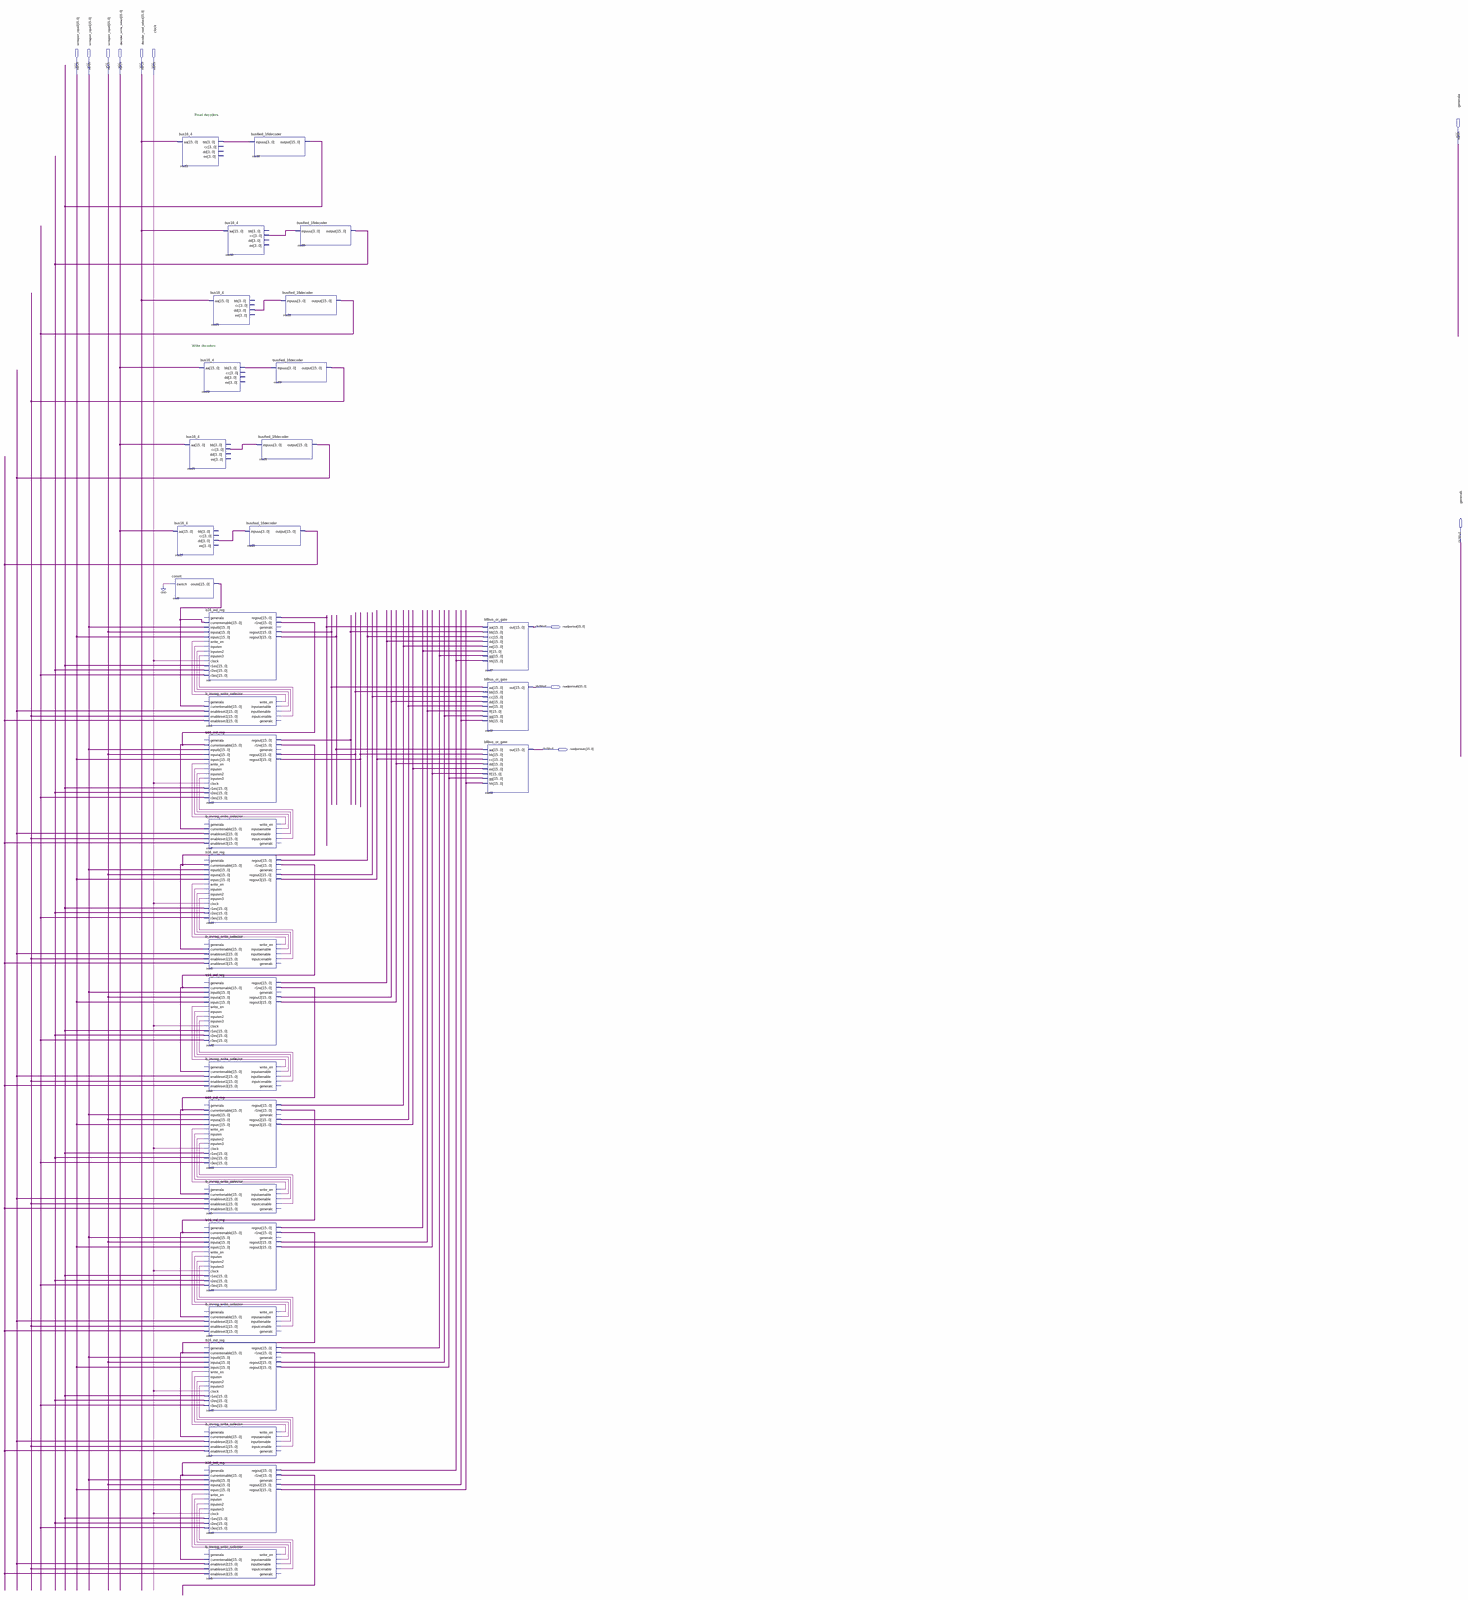
[diagram p0: schematic sheet, whole]
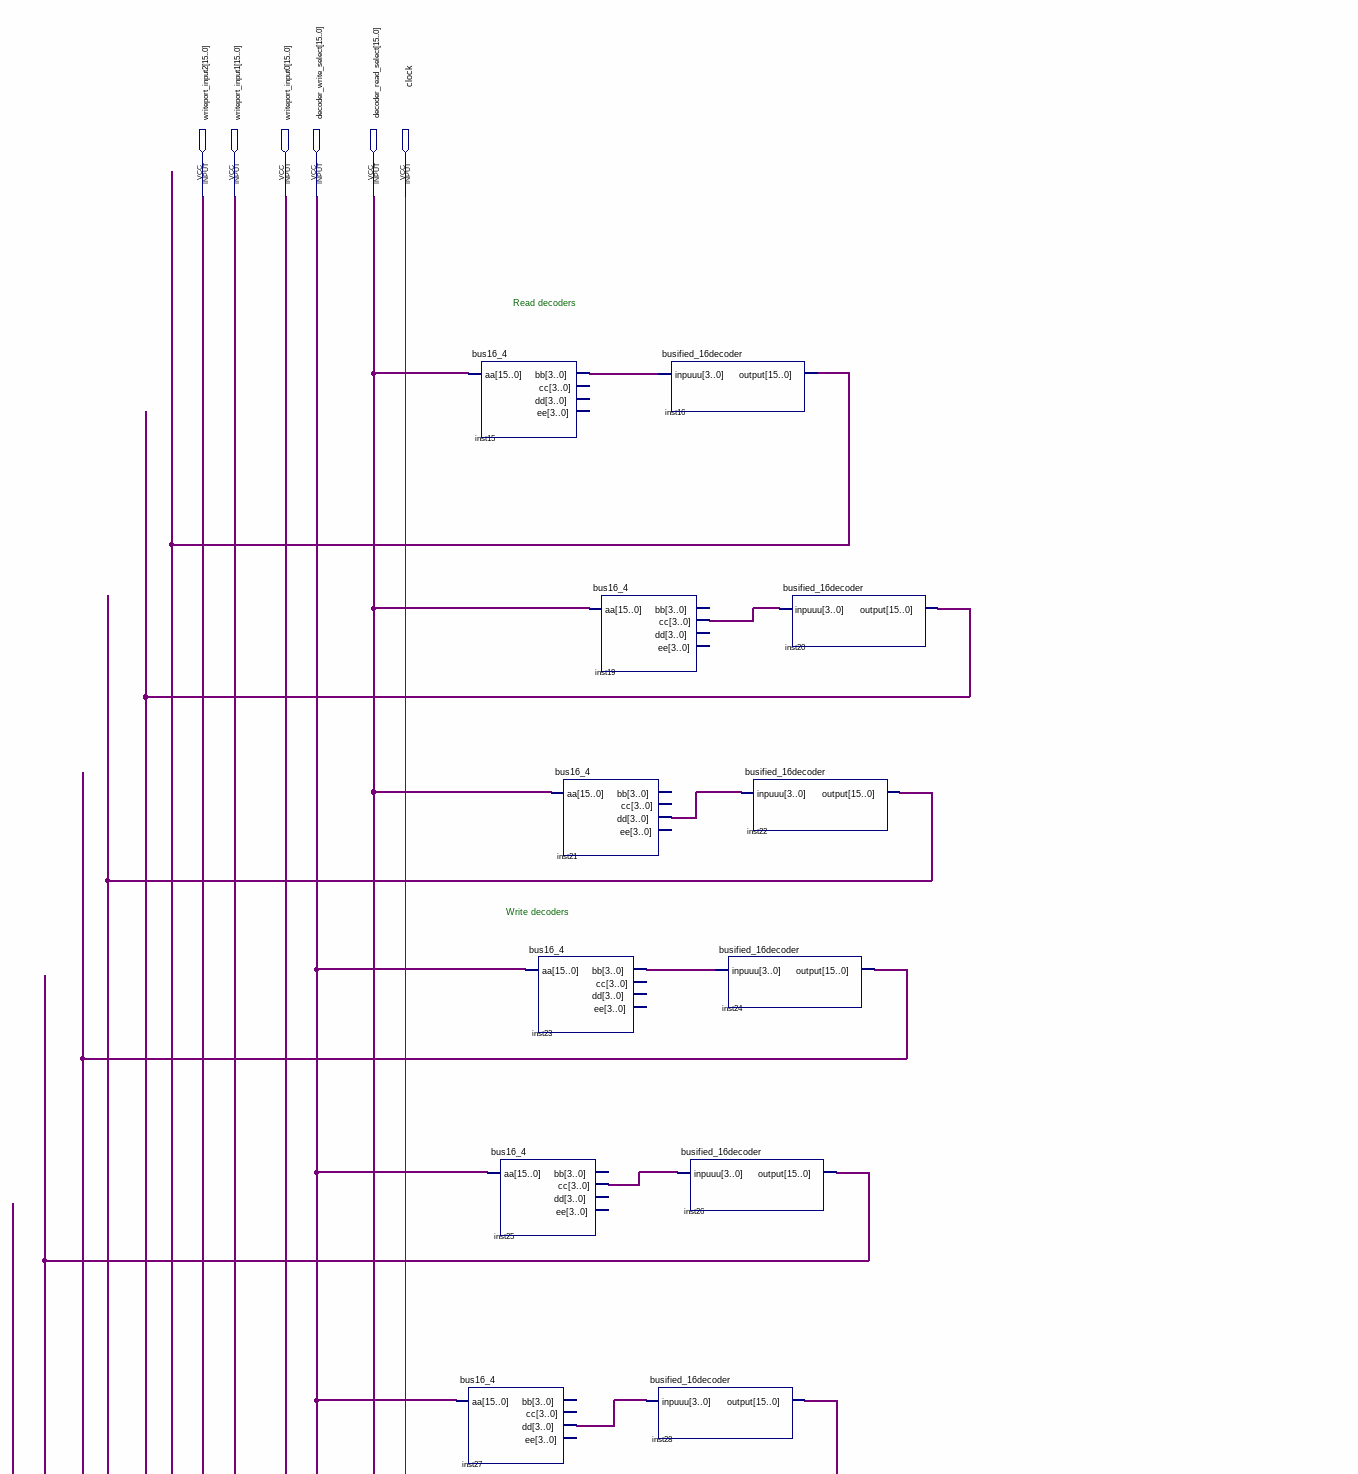
[diagram p1: schematic sheet, upper left part]
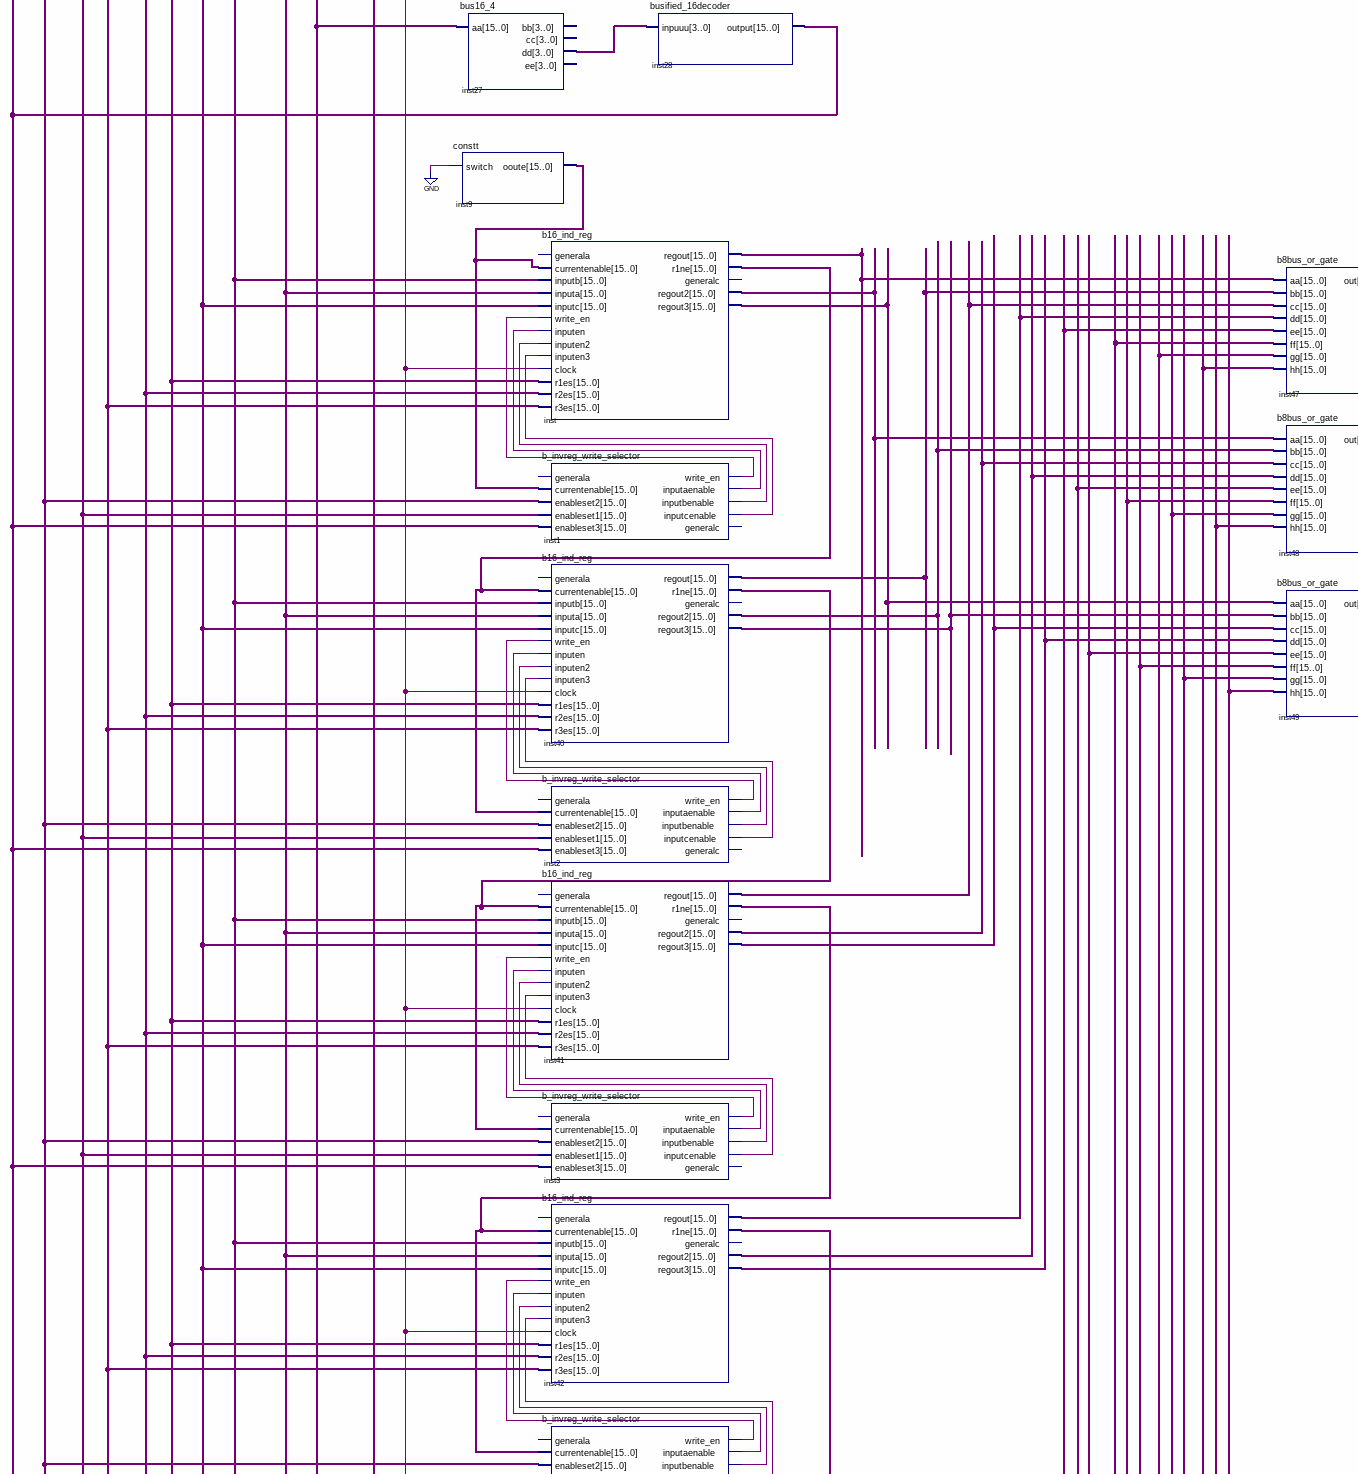
[diagram p2: schematic sheet, middle left part]
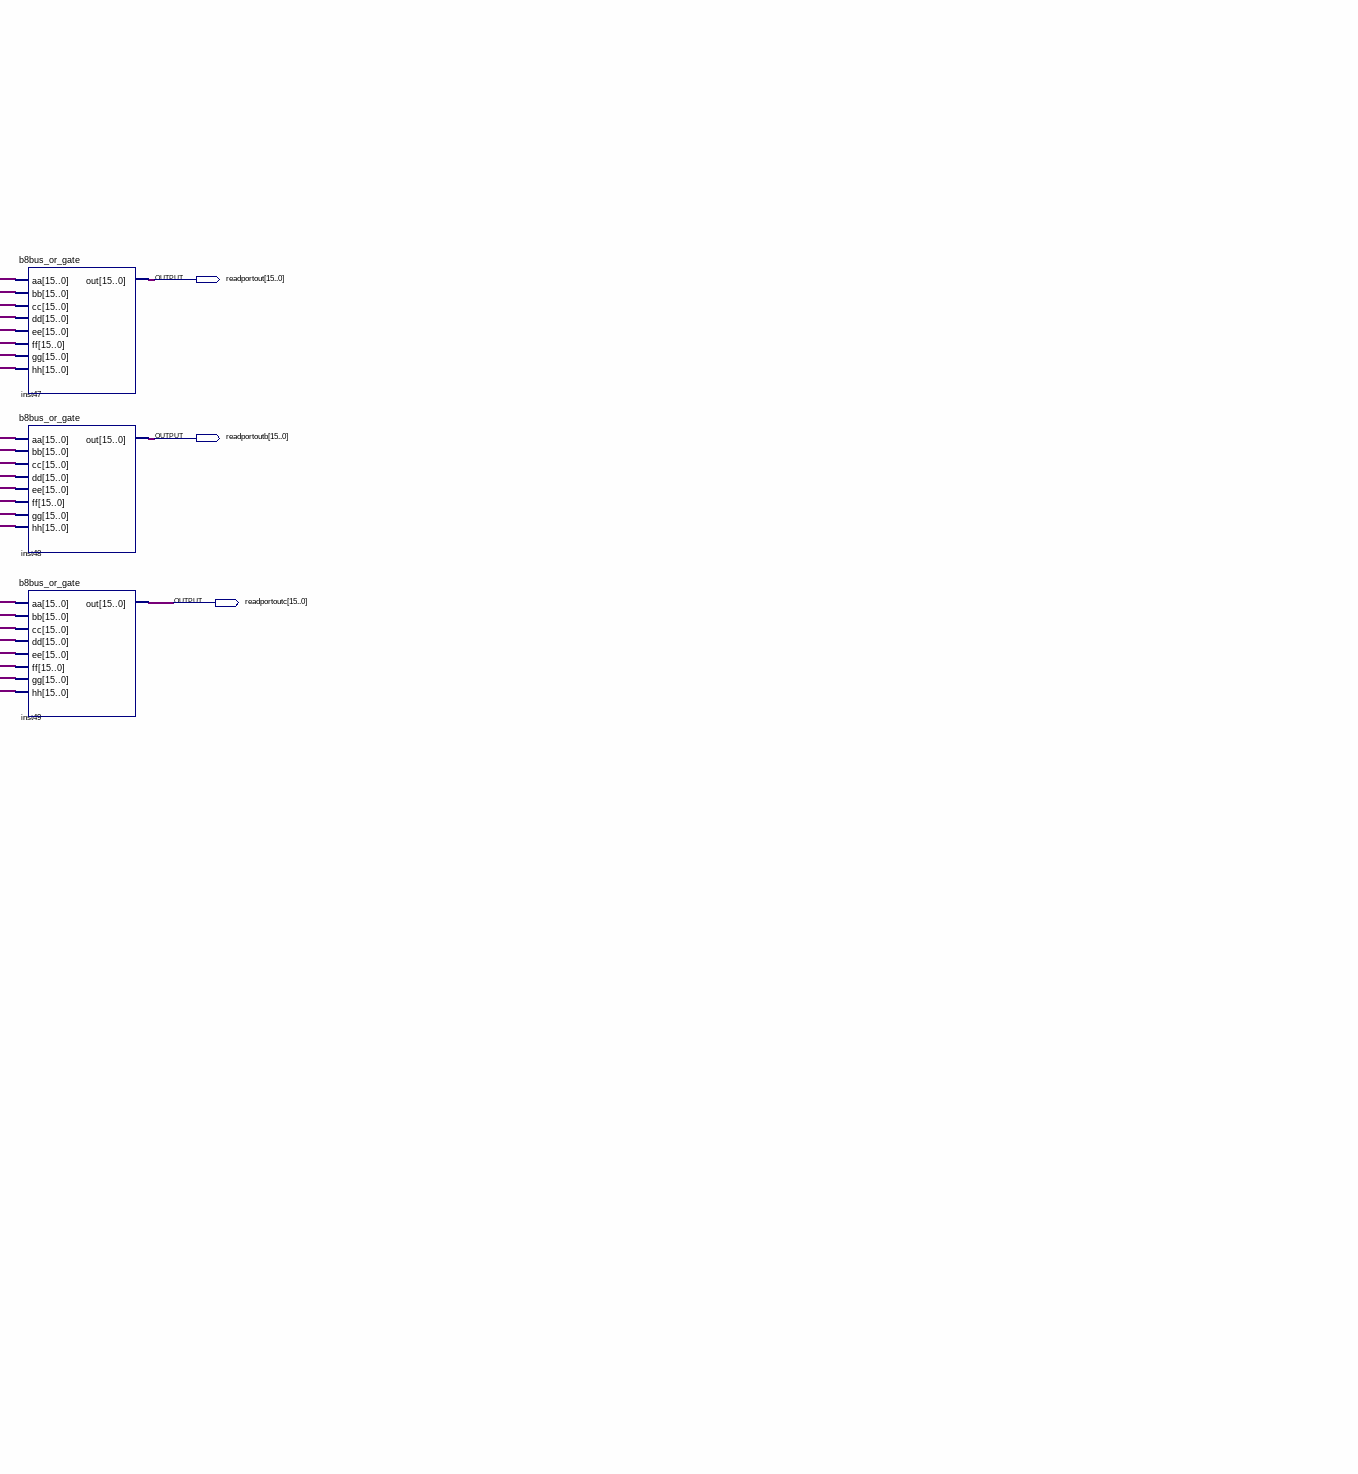
[diagram p3: schematic sheet, middle centre part]
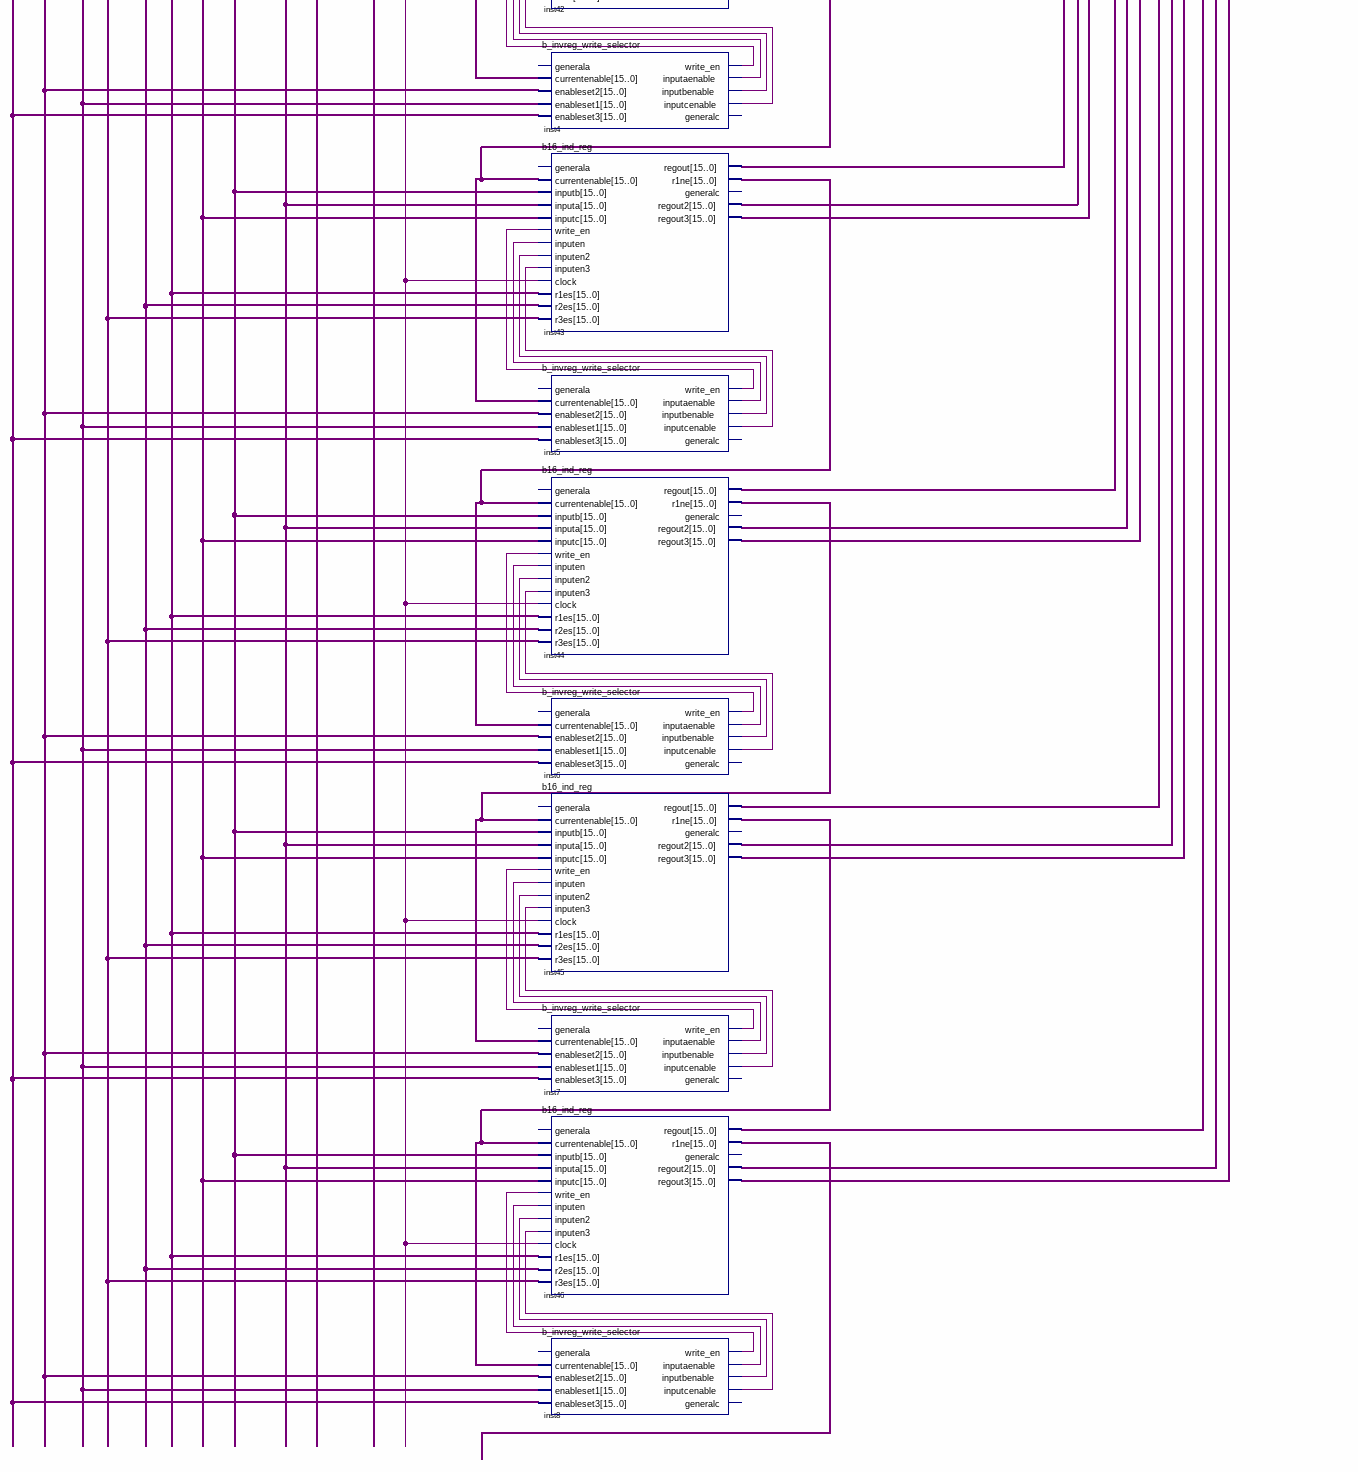
[diagram p4: schematic sheet, lower left part]
// Quartus schematic reg_mod.bdf as structural Verilog: 32 symbols, 11 pins
module reg_mod (
  input  [15:0] writeport_input2,
  input  [15:0] writeport_input1,
  input  [15:0] writeport_input0,
  input  [15:0] decoder_write_select,
  input  [15:0] decoder_read_select,
  input  clock,
  input  generala,
  output generalc,
  output [15:0] readportout,
  output [15:0] readportoutb,
  output [15:0] readportoutc
);

  wire inst1_inputaenable, inst1_inputbenable, inst1_inputcenable, inst1_write_en, inst2_inputaenable,
       inst2_inputbenable, inst2_inputcenable, inst2_write_en, inst3_inputaenable, inst3_inputbenable,
       inst3_inputcenable, inst3_write_en, inst4_inputaenable, inst4_inputbenable, inst4_inputcenable,
       inst4_write_en, inst5_inputaenable, inst5_inputbenable, inst5_inputcenable, inst5_write_en,
       inst6_inputaenable, inst6_inputbenable, inst6_inputcenable, inst6_write_en, inst7_inputaenable,
       inst7_inputbenable, inst7_inputcenable, inst7_write_en, inst8_inputaenable, inst8_inputbenable,
       inst8_inputcenable, inst8_write_en;
  wire [3:0] inst15_bb, inst19_cc, inst21_dd, inst23_bb, inst25_cc, inst27_dd;
  wire [15:0] inst9_ooute, inst16_output, inst20_output, inst22_output, inst24_output, inst26_output,
       inst28_output, inst40_r1ne, inst40_regout, inst40_regout2, inst40_regout3, inst41_r1ne, inst41_regout,
       inst41_regout2, inst41_regout3, inst42_r1ne, inst42_regout, inst42_regout2, inst42_regout3,
       inst43_r1ne, inst43_regout, inst43_regout2, inst43_regout3, inst44_r1ne, inst44_regout,
       inst44_regout2, inst44_regout3, inst45_r1ne, inst45_regout, inst45_regout2, inst45_regout3,
       inst46_r1ne, inst46_regout, inst46_regout2, inst46_regout3, inst_r1ne, inst_regout, inst_regout2,
       inst_regout3;

  bus16_4 inst15 (.aa(decoder_read_select), .bb(inst15_bb));  // open: cc, dd, ee
  bus16_4 inst27 (.aa(decoder_write_select), .dd(inst27_dd));  // open: bb, cc, ee
  constt inst9 (.switch(1'b0), .ooute(inst9_ooute));
  bus16_4 inst23 (.aa(decoder_write_select), .bb(inst23_bb));  // open: cc, dd, ee
  bus16_4 inst25 (.aa(decoder_write_select), .cc(inst25_cc));  // open: bb, dd, ee
  bus16_4 inst21 (.aa(decoder_read_select), .dd(inst21_dd));  // open: bb, cc, ee
  b16_ind_reg inst (
    .currentenable(inst9_ooute), .inputb(writeport_input1), .inputa(writeport_input0),
    .inputc(writeport_input2), .write_en(inst1_write_en), .inputen(inst1_inputaenable),
    .inputen2(inst1_inputbenable), .inputen3(inst1_inputcenable), .clock(clock), .r1es(inst16_output),
    .r2es(inst20_output), .r3es(inst22_output), .regout(inst_regout), .r1ne(inst_r1ne),
    .regout2(inst_regout2), .regout3(inst_regout3));  // open: generala, generalc
  b_invreg_write_selector inst1 (
    .currentenable(inst9_ooute), .enableset2(inst26_output), .enableset1(inst24_output),
    .enableset3(inst28_output), .write_en(inst1_write_en), .inputaenable(inst1_inputaenable),
    .inputbenable(inst1_inputbenable), .inputcenable(inst1_inputcenable));  // open: generala, generalc
  b16_ind_reg inst40 (
    .currentenable(inst_r1ne), .inputb(writeport_input1), .inputa(writeport_input0),
    .inputc(writeport_input2), .write_en(inst2_write_en), .inputen(inst2_inputaenable),
    .inputen2(inst2_inputbenable), .inputen3(inst2_inputcenable), .clock(clock), .r1es(inst16_output),
    .r2es(inst20_output), .r3es(inst22_output), .regout(inst40_regout), .r1ne(inst40_r1ne),
    .regout2(inst40_regout2), .regout3(inst40_regout3));  // open: generala, generalc
  b_invreg_write_selector inst2 (
    .currentenable(inst_r1ne), .enableset2(inst26_output), .enableset1(inst24_output),
    .enableset3(inst28_output), .write_en(inst2_write_en), .inputaenable(inst2_inputaenable),
    .inputbenable(inst2_inputbenable), .inputcenable(inst2_inputcenable));  // open: generala, generalc
  b16_ind_reg inst41 (
    .currentenable(inst40_r1ne), .inputb(writeport_input1), .inputa(writeport_input0),
    .inputc(writeport_input2), .write_en(inst3_write_en), .inputen(inst3_inputaenable),
    .inputen2(inst3_inputbenable), .inputen3(inst3_inputcenable), .clock(clock), .r1es(inst16_output),
    .r2es(inst20_output), .r3es(inst22_output), .regout(inst41_regout), .r1ne(inst41_r1ne),
    .regout2(inst41_regout2), .regout3(inst41_regout3));  // open: generala, generalc
  b_invreg_write_selector inst3 (
    .currentenable(inst40_r1ne), .enableset2(inst26_output), .enableset1(inst24_output),
    .enableset3(inst28_output), .write_en(inst3_write_en), .inputaenable(inst3_inputaenable),
    .inputbenable(inst3_inputbenable), .inputcenable(inst3_inputcenable));  // open: generala, generalc
  b16_ind_reg inst42 (
    .currentenable(inst41_r1ne), .inputb(writeport_input1), .inputa(writeport_input0),
    .inputc(writeport_input2), .write_en(inst4_write_en), .inputen(inst4_inputaenable),
    .inputen2(inst4_inputbenable), .inputen3(inst4_inputcenable), .clock(clock), .r1es(inst16_output),
    .r2es(inst20_output), .r3es(inst22_output), .regout(inst42_regout), .r1ne(inst42_r1ne),
    .regout2(inst42_regout2), .regout3(inst42_regout3));  // open: generala, generalc
  b_invreg_write_selector inst4 (
    .currentenable(inst41_r1ne), .enableset2(inst26_output), .enableset1(inst24_output),
    .enableset3(inst28_output), .write_en(inst4_write_en), .inputaenable(inst4_inputaenable),
    .inputbenable(inst4_inputbenable), .inputcenable(inst4_inputcenable));  // open: generala, generalc
  b16_ind_reg inst43 (
    .currentenable(inst42_r1ne), .inputb(writeport_input1), .inputa(writeport_input0),
    .inputc(writeport_input2), .write_en(inst5_write_en), .inputen(inst5_inputaenable),
    .inputen2(inst5_inputbenable), .inputen3(inst5_inputcenable), .clock(clock), .r1es(inst16_output),
    .r2es(inst20_output), .r3es(inst22_output), .regout(inst43_regout), .r1ne(inst43_r1ne),
    .regout2(inst43_regout2), .regout3(inst43_regout3));  // open: generala, generalc
  b_invreg_write_selector inst5 (
    .currentenable(inst42_r1ne), .enableset2(inst26_output), .enableset1(inst24_output),
    .enableset3(inst28_output), .write_en(inst5_write_en), .inputaenable(inst5_inputaenable),
    .inputbenable(inst5_inputbenable), .inputcenable(inst5_inputcenable));  // open: generala, generalc
  b16_ind_reg inst44 (
    .currentenable(inst43_r1ne), .inputb(writeport_input1), .inputa(writeport_input0),
    .inputc(writeport_input2), .write_en(inst6_write_en), .inputen(inst6_inputaenable),
    .inputen2(inst6_inputbenable), .inputen3(inst6_inputcenable), .clock(clock), .r1es(inst16_output),
    .r2es(inst20_output), .r3es(inst22_output), .regout(inst44_regout), .r1ne(inst44_r1ne),
    .regout2(inst44_regout2), .regout3(inst44_regout3));  // open: generala, generalc
  b_invreg_write_selector inst6 (
    .currentenable(inst43_r1ne), .enableset2(inst26_output), .enableset1(inst24_output),
    .enableset3(inst28_output), .write_en(inst6_write_en), .inputaenable(inst6_inputaenable),
    .inputbenable(inst6_inputbenable), .inputcenable(inst6_inputcenable));  // open: generala, generalc
  b16_ind_reg inst45 (
    .currentenable(inst44_r1ne), .inputb(writeport_input1), .inputa(writeport_input0),
    .inputc(writeport_input2), .write_en(inst7_write_en), .inputen(inst7_inputaenable),
    .inputen2(inst7_inputbenable), .inputen3(inst7_inputcenable), .clock(clock), .r1es(inst16_output),
    .r2es(inst20_output), .r3es(inst22_output), .regout(inst45_regout), .r1ne(inst45_r1ne),
    .regout2(inst45_regout2), .regout3(inst45_regout3));  // open: generala, generalc
  b_invreg_write_selector inst7 (
    .currentenable(inst44_r1ne), .enableset2(inst26_output), .enableset1(inst24_output),
    .enableset3(inst28_output), .write_en(inst7_write_en), .inputaenable(inst7_inputaenable),
    .inputbenable(inst7_inputbenable), .inputcenable(inst7_inputcenable));  // open: generala, generalc
  b16_ind_reg inst46 (
    .currentenable(inst45_r1ne), .inputb(writeport_input1), .inputa(writeport_input0),
    .inputc(writeport_input2), .write_en(inst8_write_en), .inputen(inst8_inputaenable),
    .inputen2(inst8_inputbenable), .inputen3(inst8_inputcenable), .clock(clock), .r1es(inst16_output),
    .r2es(inst20_output), .r3es(inst22_output), .regout(inst46_regout), .r1ne(inst46_r1ne),
    .regout2(inst46_regout2), .regout3(inst46_regout3));  // open: generala, generalc
  b_invreg_write_selector inst8 (
    .currentenable(inst45_r1ne), .enableset2(inst26_output), .enableset1(inst24_output),
    .enableset3(inst28_output), .write_en(inst8_write_en), .inputaenable(inst8_inputaenable),
    .inputbenable(inst8_inputbenable), .inputcenable(inst8_inputcenable));  // open: generala, generalc
  bus16_4 inst19 (.aa(decoder_read_select), .cc(inst19_cc));  // open: bb, dd, ee
  busified_16decoder inst16 (.inpuuu(inst15_bb), .\output (inst16_output));
  busified_16decoder inst26 (.inpuuu(inst25_cc), .\output (inst26_output));
  busified_16decoder inst28 (.inpuuu(inst27_dd), .\output (inst28_output));
  busified_16decoder inst24 (.inpuuu(inst23_bb), .\output (inst24_output));
  busified_16decoder inst20 (.inpuuu(inst19_cc), .\output (inst20_output));
  busified_16decoder inst22 (.inpuuu(inst21_dd), .\output (inst22_output));
  b8bus_or_gate inst47 (
    .aa(inst_regout), .bb(inst40_regout), .cc(inst41_regout), .dd(inst42_regout), .ee(inst43_regout),
    .ff(inst44_regout), .gg(inst45_regout), .hh(inst46_regout), .out(readportout));
  b8bus_or_gate inst48 (
    .aa(inst_regout2), .bb(inst40_regout2), .cc(inst41_regout2), .dd(inst42_regout2), .ee(inst43_regout2),
    .ff(inst44_regout2), .gg(inst45_regout2), .hh(inst46_regout2), .out(readportoutb));
  b8bus_or_gate inst49 (
    .aa(inst_regout3), .bb(inst40_regout3), .cc(inst41_regout3), .dd(inst42_regout3), .ee(inst43_regout3),
    .ff(inst44_regout3), .gg(inst45_regout3), .hh(inst46_regout3), .out(readportoutc));

  // Notes on the sheet:
  //   Read decoders
  //   Write decoders 
endmodule
